# EasyEDA schematic Танковый бой.json
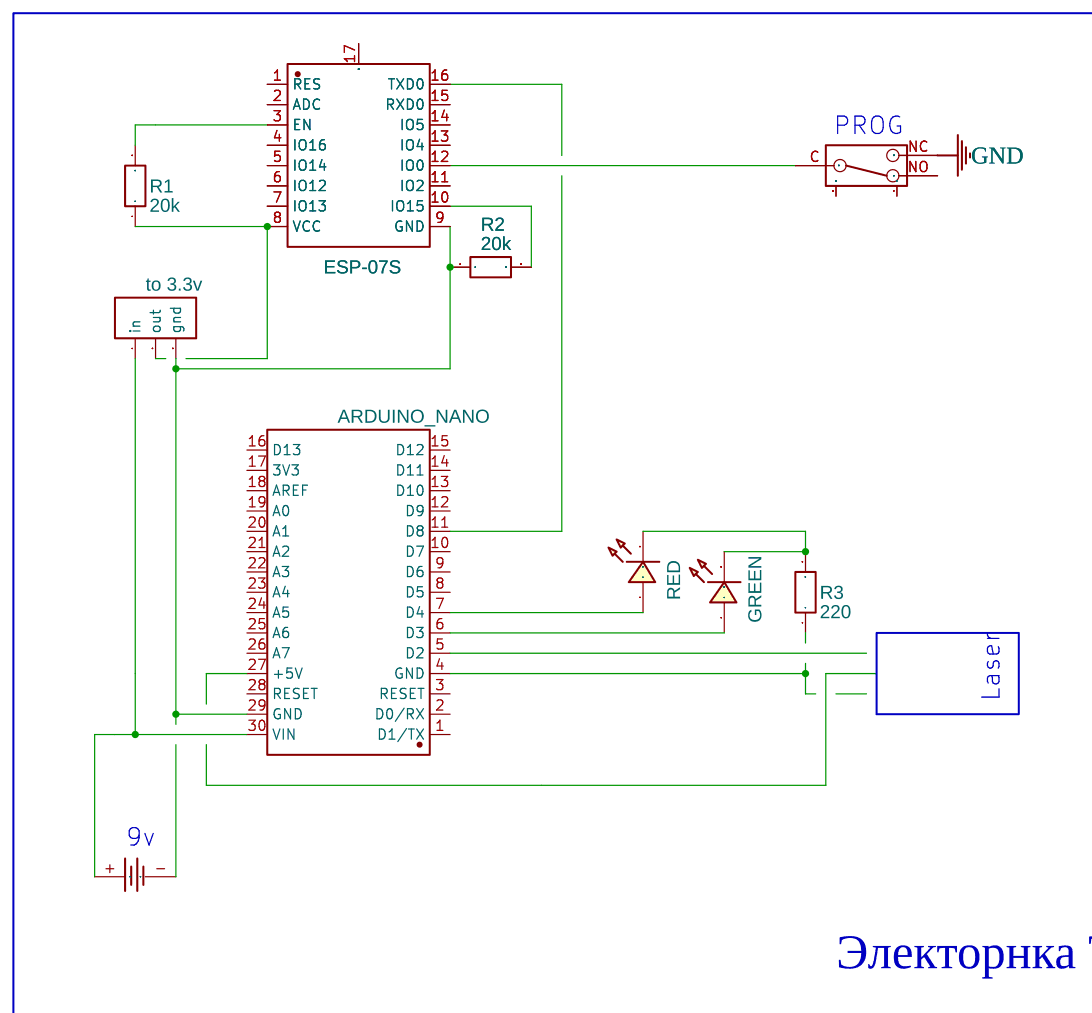
[diagram p0: schematic sheet]

## Parts
B1  CR1220-2  [BAT-SMD_CR1220-2]
GREEN  LED-0603_R  [LED0603_RED]
LED1  RED  [LED0603_RED]
P1  to 3.3v  [CONN-TH_3P-P5.00]
R1  20k  [R0603]
R2  20k  [R0603]
R3  220  [R0603]
SW1  SK-12D02-VG5  [SW-TH_SK-12D02VG3]
U1  ARDUINO_NANO  [COMM-TH_ARDUINO_NANO]
U2  ESP-07S  [WIFIM-SMD_16P-L17.0-W16.0-P2.00]

## Library data of the parts
B1 = CR1220-2: Supplier: LCSC; Manufacturer: Q&J; image: //image.lceda.cn/szlcsc/C70381.jpg; Supplier Part: C70381
GREEN LED1 = LED-0603_R: Manufacturer: EVERLIGHT(台湾亿光); Manufacturer Part: 19-217/R6C-AL1M2VY/3T; Supplier Part: C72044; Supplier: LCSC; Contributor: LCEDA_01
P1 = CONN-TH_3P-P5.00: Supplier: LCSC; Contributor: LCEDA_Lib
R1-R3 = R_0603_EU: Contributor: LCEDA_Lib
SW1 = SK-12D02-VG5: Supplier: LCSC; Supplier Part: C136722; Manufacturer: Rectangular Connectors - Contacts; Contributor: LCSC
U1 = ARDUINO_NANO: Supplier: LCSC; Supplier Part: C9900017879; Manufacturer: null; JLCPCB Part Class: Extended Part; Contributor: lcsc
U2 = WT8266-S3 ESP-07S: Supplier: LCSC; Supplier Part: C477828; Manufacturer: Wireless-tag(启明云端); Contributor: LCSC; JLCPCB Part Class: Extended Part

## Nets
GND: SW1.NC(3)
Net-(B1-+): B1.+(1) P1.1(in) U1.30(VIN)
Net-(GREEN-1): GREEN.1 U1.6(D3)
Net-(GREEN-2): GREEN.2 LED1.2 R3.2
Net-(LED1-1): LED1.1 U1.7(D4)
Net-(P1-3): P1.3(gnd) R2.1 U1.29(GND) U2.9(GND)
Net-(R1-1): R1.1 U2.8(VCC)
Net-(R1-2): R1.2 U2.3(EN)
Net-(R2-2): R2.2 U2.10(IO15)
Net-(SW1-C): SW1.C(2) U2.12(IO0)

Not connected (* = marked no-connect by the designer): B1 -(2); P1 2(out); R3 1; SW1 4 5 NO(1); U1 1(D1/TX) 2(D0/RX) 3(RESET) 4(GND) 5(D2) 8(D5) 9(D6) 10(D7) 11(D8) 12(D9) 13(D10) 14(D11) 15(D12) 16(D13) 17(3V3) 18(AREF) 19(A0) 20(A1) 21(A2) 22(A3) 23(A4) 24(A5) 25(A6) 26(A7) 27(+5V) 28(RESET); U2 1(RES) 2(ADC) 4(IO16) 5(IO14) 6(IO12) 7(IO13) 11(IO2) 13(IO4) 14(IO5) 15(RXD0) 16(TXD0) 17(PAD)

## Notes on the sheet
- PROG
- Laser
- 9v
- Электорнка Танчика
